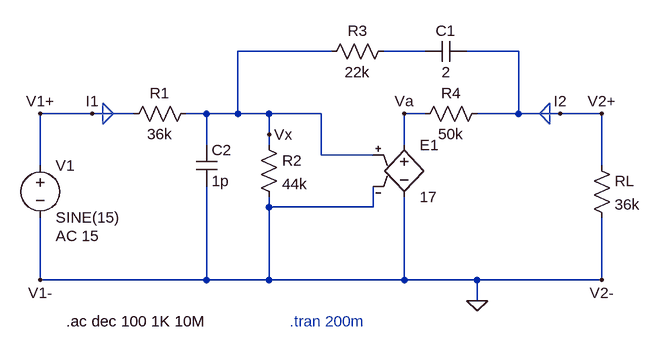
[diagram p0: schematic Q2 Draft.asc]
Q2 Draft.asc, the LTspice schematic file:
Version 4
SHEET 1 880 680
WIRE 352 16 208 16
WIRE 496 16 432 16
WIRE 640 16 560 16
WIRE -16 112 -96 112
WIRE 48 112 -16 112
WIRE 160 112 128 112
WIRE 208 112 208 16
WIRE 208 112 160 112
WIRE 256 112 208 112
WIRE 336 112 256 112
WIRE 496 112 464 112
WIRE 640 112 640 16
WIRE 640 112 576 112
WIRE 704 112 640 112
WIRE 768 112 704 112
WIRE 256 144 256 112
WIRE 160 160 160 112
WIRE 256 160 256 144
WIRE 464 160 464 112
WIRE 336 176 336 112
WIRE 416 176 336 176
WIRE -96 192 -96 112
WIRE 768 192 768 112
WIRE 256 256 256 240
WIRE 416 256 416 224
WIRE 416 256 256 256
WIRE -96 368 -96 272
WIRE 160 368 160 224
WIRE 160 368 -96 368
WIRE 256 368 256 256
WIRE 256 368 160 368
WIRE 464 368 464 240
WIRE 464 368 256 368
WIRE 576 368 464 368
WIRE 768 368 768 272
WIRE 768 368 576 368
WIRE 576 400 576 368
FLAG 256 144 Vx
FLAG -16 112 I1
FLAG 576 400 0
FLAG 704 112 I2
FLAG -96 112 V1+
FLAG -96 368 V1-
FLAG 768 112 V2+
FLAG 768 368 V2-
FLAG 464 112 Va
SYMBOL res 144 96 R90
WINDOW 0 0 56 VBottom 2
WINDOW 3 32 56 VTop 2
SYMATTR InstName R1
SYMATTR Value 36k
SYMBOL cap 144 160 R0
SYMATTR InstName C2
SYMATTR Value 1p
SYMBOL res 240 144 R0
SYMATTR InstName R2
SYMATTR Value 44k
SYMBOL res 448 0 R90
WINDOW 0 0 56 VBottom 2
WINDOW 3 32 56 VTop 2
SYMATTR InstName R3
SYMATTR Value 22k
SYMBOL cap 560 0 R90
WINDOW 0 0 32 VBottom 2
WINDOW 3 32 32 VTop 2
SYMATTR InstName C1
SYMATTR Value 2
SYMBOL res 592 96 R90
WINDOW 0 0 56 VBottom 2
WINDOW 3 32 56 VTop 2
SYMATTR InstName R4
SYMATTR Value 50k
SYMBOL voltage -96 176 R0
WINDOW 123 24 124 Left 2
WINDOW 39 0 0 Left 0
SYMATTR Value2 AC 15
SYMATTR InstName V1
SYMATTR Value SINE(15)
SYMBOL res 752 176 R0
SYMATTR InstName RL
SYMATTR Value 36k
SYMBOL e 464 144 R0
SYMATTR InstName E1
SYMATTR Value 17
TEXT -56 432 Left 2 !.ac dec 100 1K 10M
TEXT 288 432 Left 2 ;.tran 200m
LINE Normal 0 128 0 112 2
LINE Normal 0 96 0 128
LINE Normal 16 112 0 96
LINE Normal 0 128 16 112
LINE Normal 688 96 688 112
LINE Normal 672 112 688 96
LINE Normal 688 128 672 112
LINE Normal 688 112 688 128

The netlist it stands for:
* Q2 Draft.asc
R1 Vx V1+ 36k
C2 Vx 0 1p
R2 Vx 0 44k
R3 N001 Vx 22k
C1 V2+ N001 2
R4 V2+ Va 50k
V1 V1+ 0 SINE(15) AC 15
RL V2+ 0 36k
E1 Va 0 Vx 0 17
.ac dec 100 1K 10M
* .tran 200m
.backanno
.end